# EAGLE design Axon_revA (EAGLE 8.0.0)
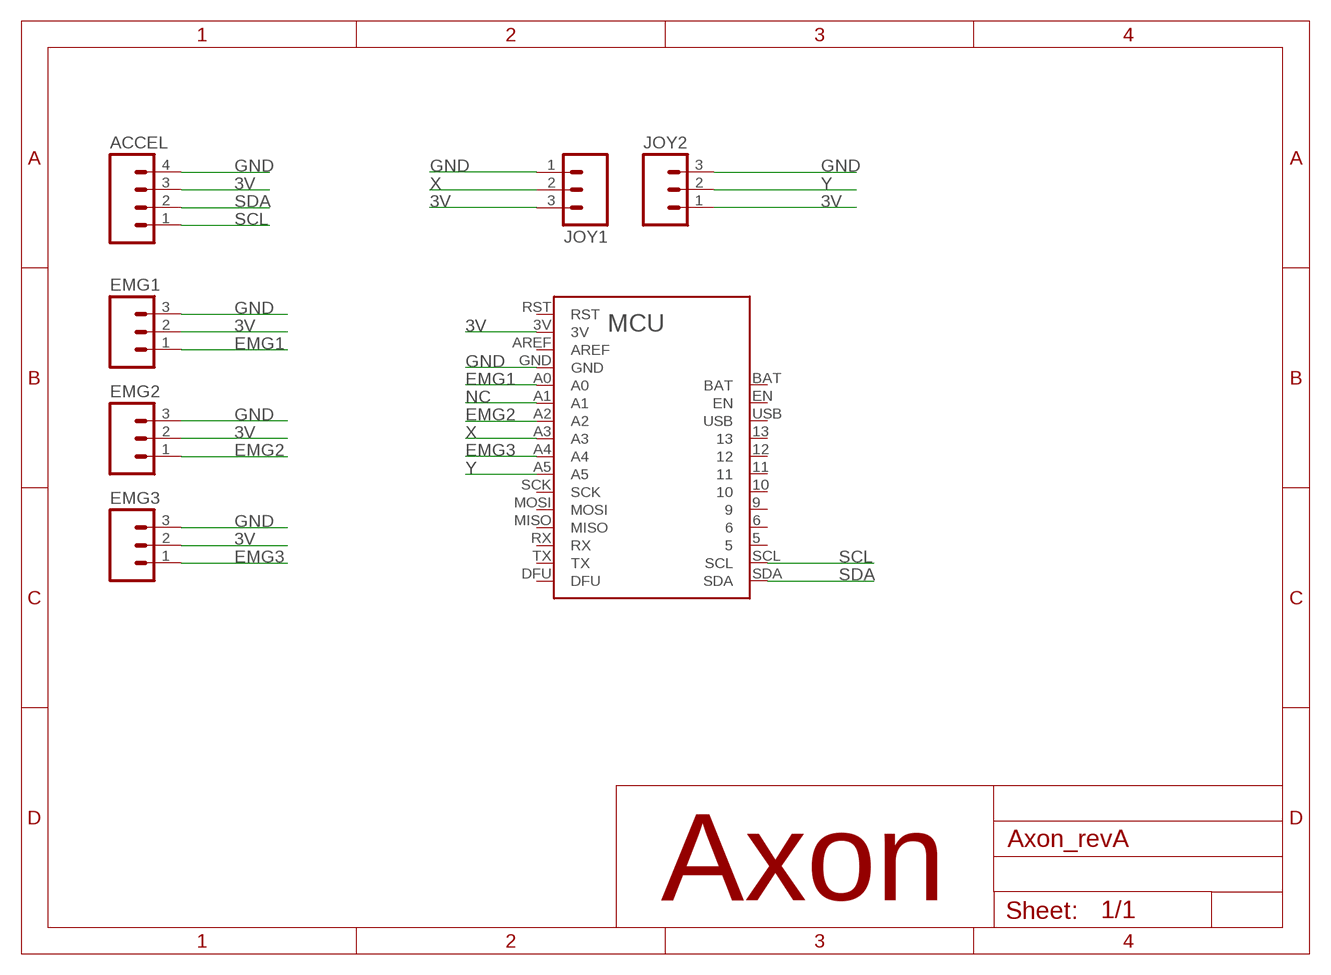
[diagram p0: schematic, sheet 1]

## Parts
ACCEL  M04POLAR  [MOLEX-1X4]
EMG1  M03POLAR  [MOLEX-1X3]
EMG2  M03POLAR  [MOLEX-1X3]
EMG3  M03POLAR  [MOLEX-1X3]
JOY1  M03PTH  [1X03]
JOY2  M03PTH  [1X03]
MCU  BLUEFRUIT  [BLUEFRUIT]

## Nets
3V: ACCEL.3 EMG1.2 EMG2.2 EMG3.2 JOY1.3 JOY2.1 MCU.3V
EMG1: EMG1.1 MCU.A0
EMG2: EMG2.1 MCU.A2
EMG3: EMG3.1 MCU.A4
GND: ACCEL.4 EMG1.3 EMG2.3 EMG3.3 JOY1.1 JOY2.3 MCU.GND
NC: MCU.A1
SCL: ACCEL.1 MCU.SCL
SDA: ACCEL.2 MCU.SDA
X: JOY1.2 MCU.A3
Y: JOY2.2 MCU.A5
Unconnected: MCU.5 MCU.6 MCU.9 MCU.10 MCU.11 MCU.12 MCU.13 MCU.AREF MCU.BAT MCU.DFU MCU.EN MCU.MISO MCU.MOSI MCU.RST MCU.RX MCU.SCK MCU.TX MCU.USB

## Notes on the sheet
- Axon

## Library data of the parts
ACCEL = SparkFun-Connectors:M04: Header 4 Standard 4-pin 0.1" header. Use with straight break away headers (SKU : PRT-00116), right angle break away headers (PRT-00553), swiss pins (PRT-00743), machine pins (PRT-00117), and female headers (PRT-00115). Molex polarized connector foot print use with SKU : PRT-08231 with associated crimp pins and housings. 1MM SMD Version SKU: PRT-10208
EMG1-EMG3 JOY1 JOY2 = SparkFun-Connectors:M03: Header 3 Standard 3-pin 0.1" header. Use with straight break away headers (SKU : PRT-00116), right angle break away headers (PRT-00553), swiss pins (PRT-00743), machine pins (PRT-00117), and female headers (PRT-00115). Molex polarized connector foot print use with SKU : PRT-08232 with associated crimp pins and housings.
MCU = myParts:BLUEFRUIT

## Board
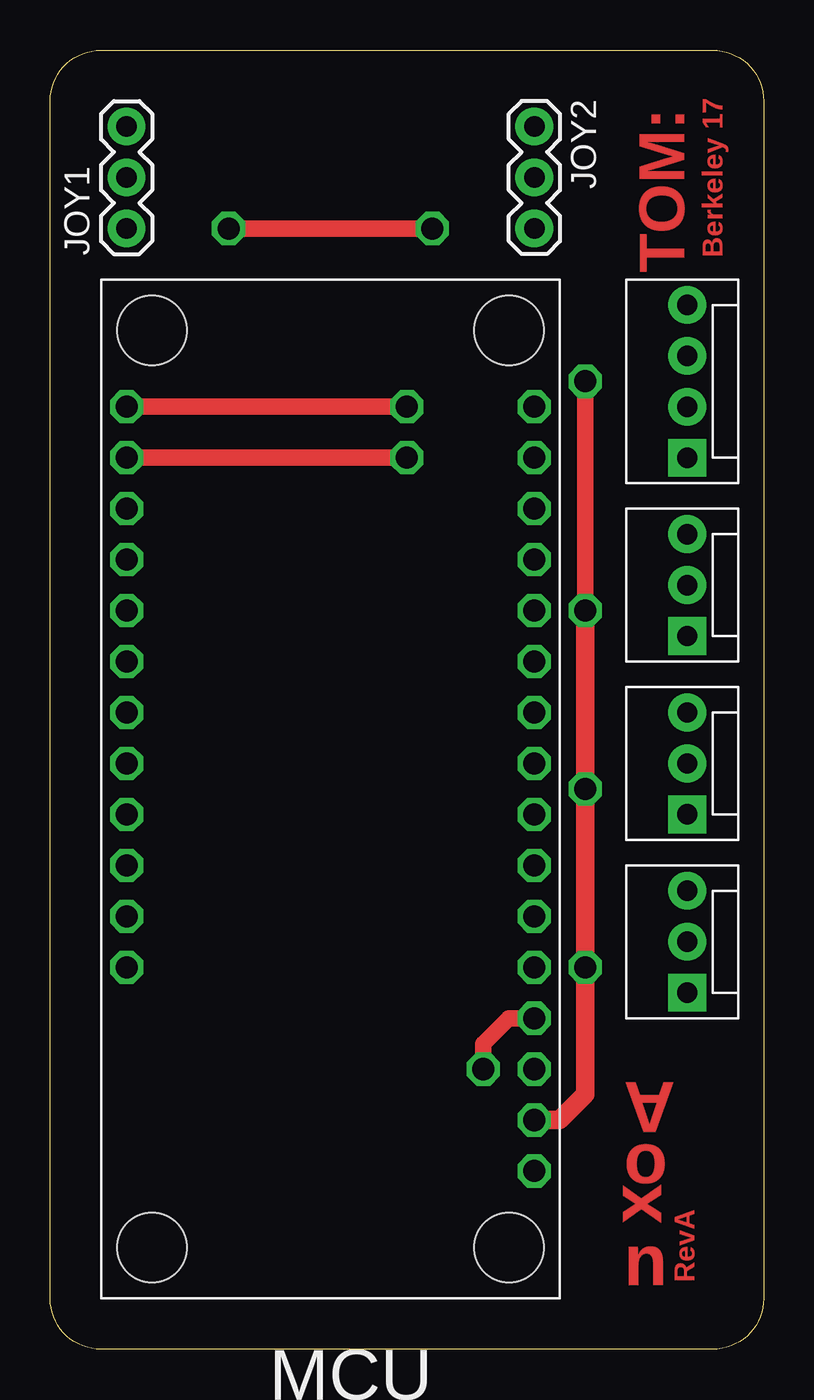
[diagram p1: board, top side]
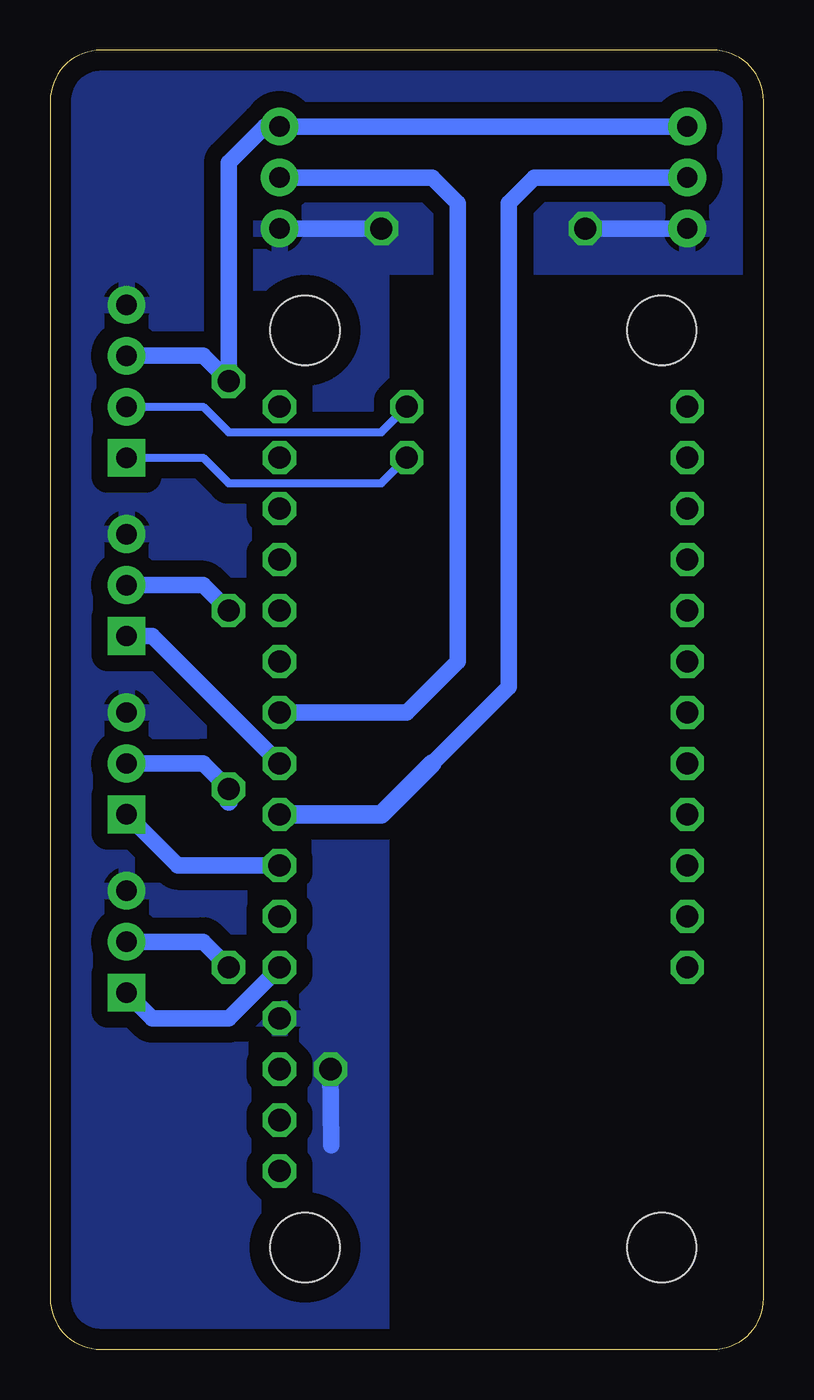
[diagram p2: board, bottom side, seen from below]

Size 35.56 x 64.77 mm. Coordinates in mm from the lower left corner, seen from the top.
Outline: 35.56,62.23 35.56,2.54 arc-90 33.02,0 2.54,0 arc-90 0,2.54 0,62.23 arc-90 2.54,64.77 33.02,64.77 arc-90 35.56,62.23
Copper layers (1*16): Top 0.035mm / dielectric 1.5mm / Bottom 0.035mm
Design rules "default": minimum track width 10mil, minimum drill 24mil, track to track 8mil, track to pad 8mil, pad to pad 8mil, via to via 8mil, smd to smd 8mil, copper to edge 40mil, drill to drill 8mil, minimum pad ring 10mil, minimum via ring 8mil, stop-mask expansion 4mil, vias tented up to drill 0mil, thermal gap 10mil

### Footprints (pad centres in the part's own frame; a part is rotated, then mirrored left to right if it is on the bottom)
MOLEX-1X4 = drill 1.016 pad 1.88 square: 1 0,0 | drill 1.016 pad 1.88: 2 2.54,0; 3 5.08,0; 4 7.62,0
MOLEX-1X3 = drill 1.016 pad 1.88 square: 1 0,0 | drill 1.016 pad 1.88: 2 2.54,0; 3 5.08,0
1X03 = drill 1.016 pad 1.88: 1 0,0; 2 2.54,0; 3 5.08,0
BLUEFRUIT = drill 1.1 octagon: 3V -7.62,10.16; 5 12.7,-20.32; 6 12.7,-17.78; 9 12.7,-15.24; 10 12.7,-12.7; 11 12.7,-10.16; 12 12.7,-7.62; 13 12.7,-5.08; A0 -7.62,2.54; A1 -7.62,0; A2 -7.62,-2.54; A3 -7.62,-5.08; A4 -7.62,-7.62; A5 -7.62,-10.16; AREF -7.62,7.62; BAT 12.7,2.54; DFU -7.62,-25.4; EN 12.7,0; GND -7.62,5.08; MISO -7.62,-17.78; MOSI -7.62,-15.24; RST -7.62,12.7; RX -7.62,-20.32; SCK -7.62,-12.7; SCL 12.7,-22.86; SDA 12.7,-25.4; TX -7.62,-22.86; USB 12.7,-2.54 | hole 3.454: -6.35,-29.21; 11.43,-29.21; 11.43,16.51; -6.35,16.51

### Placement (x,y rotation side)
ACCEL  31.75,44.45 90 top
EMG1  31.75,17.78 90 top
EMG2  31.75,26.67 90 top
EMG3  31.75,35.56 90 top
JOY1  3.81,55.88 90 top
JOY2  24.13,60.96 270 top
MCU  16.51,21.59 180 top

### Tracks (layer width: path | path; a pad name or v marks a point on that pad's centre or on a via)
3V  (via drill 1.1)
  Top 0.813: v26.67,36.83 v26.67,48.26
  Top 0.914: MCU.3V 25.4,11.43 26.67,12.7 v26.67,19.05 v26.67,27.94 v26.67,36.83
  Bottom 0.813: JOY1.3 JOY2.1 24.87,60.96 26.67,59.16 v26.67,48.26 27.94,49.53 ACCEL.3 | EMG2.2 27.94,29.21 v26.67,27.94 | v26.67,36.83 27.94,38.1 EMG3.2 | EMG1.2 27.94,20.32 v26.67,19.05
  Bottom 0.914: v26.67,27.94 26.67,27.3
EMG1
  Bottom 0.813: MCU.A0 26.67,16.51 30.48,16.51 EMG1.1
EMG2
  Bottom 0.813: EMG2.1 29.21,24.13 MCU.A2
EMG3
  Bottom 0.813: EMG3.1 30.48,35.56 MCU.A4
GND  (via drill 1.1)
  Top 0.813: MCU.GND 22.86,16.51 21.59,15.24 v21.59,13.97 | v19.05,55.88 v8.89,55.88
  Bottom 0.813: v21.59,13.97 21.56,10.16 | JOY2.3 v19.05,55.88 | v8.89,55.88 JOY1.1
  pour Bottom (isolate 0.813, rank 6): 0,67.31 40.64,67.31 40.64,-3.81 19.05,-3.81 19.05,53.97 0,53.97
SCL  (via drill 1.1)
  Top 0.813: v17.78,44.45 MCU.SCL
  Bottom 0.406: v17.78,44.45 19.05,43.18 26.67,43.18 27.94,44.45 ACCEL.1
SDA  (via drill 1.1)
  Top 0.813: v17.78,46.99 MCU.SDA
  Bottom 0.406: v17.78,46.99 19.05,45.72 26.67,45.72 27.94,46.99 ACCEL.2
X
  Bottom 0.813: JOY1.2 11.43,58.42 12.7,57.15 12.7,33.02 16.51,29.21
  Bottom 0.914: 16.51,29.21 19.05,26.67 MCU.A3
Y
  Bottom 0.813: JOY2.2 16.51,58.42 15.24,57.15 15.24,34.29 17.78,31.75 MCU.A5
(copper drawn outside any net)
  shapes: Route2 area x5605

### Text on the board
Top: TOM: | Berkeley 17 | A | x | o | RevA | n